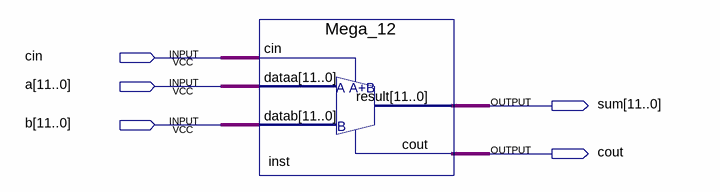
[diagram p0: schematic sheet]
// Quartus schematic KS_Mega_SM.bdf as structural Verilog: 1 symbols, 5 pins
module KS_Mega_SM (
  input  cin,
  input  [11:0] a,
  input  [11:0] b,
  output [11:0] sum,
  output cout
);

  Mega_12 inst (.cin(cin), .dataa(a), .datab(b), .result(sum), .cout(cout));
endmodule
